# Altium schematic sheet Overview.SchDoc
size A4; SheetNumber: 1; SheetTotal: 3
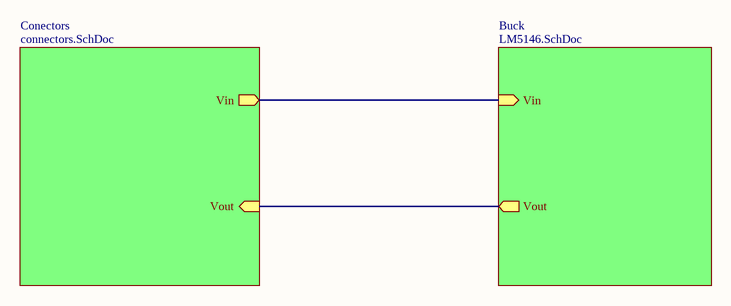
[diagram p0: Overview.SchDoc]

## Sub-sheets
Buck = LM5146.SchDoc: Vin (in), Vout (out)
Conectors = connectors.SchDoc: Vin (out), Vout (in)

## Nets
(unnamed): sheet Buck/Vin, sheet Conectors/Vin
(unnamed): sheet Buck/Vout, sheet Conectors/Vout